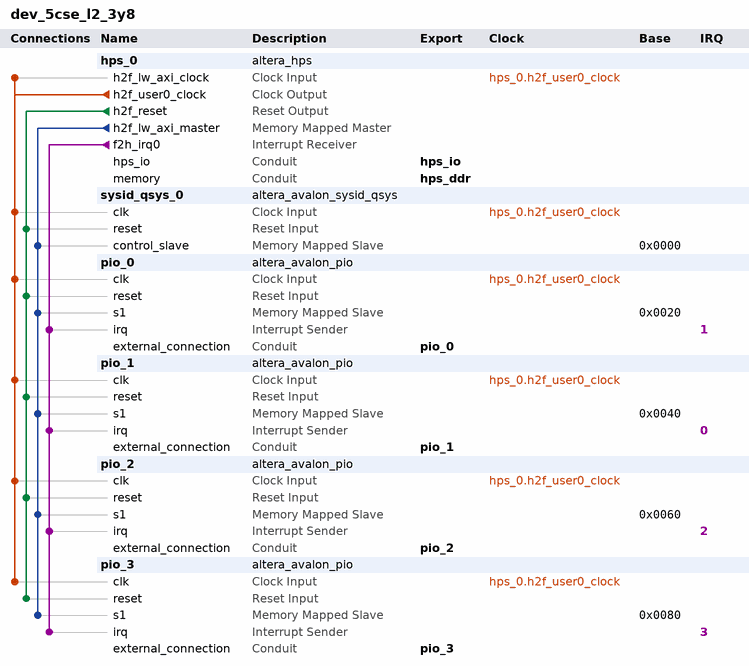
[diagram p0: system contents]
# Platform Designer (Qsys) system dev_5cse_l2_3y8, Cyclone V 5CSEBA2U23C8S
# Parameters at their usual value, and those the tool derives, are not listed.
package require -exact qsys 20.1
create_system dev_5cse_l2_3y8
set_project_property DEVICE_FAMILY {Cyclone V}
set_project_property DEVICE 5CSEBA2U23C8S

add_instance hps_0 altera_hps 20.1
set_instance_parameter_value hps_0 CAN0_Mode CAN
set_instance_parameter_value hps_0 CAN0_PinMuxing {HPS I/O Set 0}
set_instance_parameter_value hps_0 CAN1_Mode CAN
set_instance_parameter_value hps_0 CAN1_PinMuxing {HPS I/O Set 1}
set_instance_parameter_value hps_0 EMAC1_Mode RGMII
set_instance_parameter_value hps_0 EMAC1_PinMuxing {HPS I/O Set 0}
set_instance_parameter_value hps_0 F2SCLK_COLDRST_Enable false
set_instance_parameter_value hps_0 F2SCLK_DBGRST_Enable false
set_instance_parameter_value hps_0 F2SCLK_WARMRST_Enable false
set_instance_parameter_value hps_0 F2SINTERRUPT_Enable true
set_instance_parameter_value hps_0 F2S_Width 0
set_instance_parameter_value hps_0 FPGA_PERIPHERAL_OUTPUT_CLOCK_FREQ_EMAC0_GTX_CLK 100
set_instance_parameter_value hps_0 FPGA_PERIPHERAL_OUTPUT_CLOCK_FREQ_EMAC0_MD_CLK 100.0
set_instance_parameter_value hps_0 FPGA_PERIPHERAL_OUTPUT_CLOCK_FREQ_EMAC1_GTX_CLK 100
set_instance_parameter_value hps_0 FPGA_PERIPHERAL_OUTPUT_CLOCK_FREQ_EMAC1_MD_CLK 100.0
set_instance_parameter_value hps_0 HPS_PROTOCOL DDR3
set_instance_parameter_value hps_0 I2C0_Mode I2C
set_instance_parameter_value hps_0 I2C0_PinMuxing {HPS I/O Set 1}
set_instance_parameter_value hps_0 I2C1_Mode I2C
set_instance_parameter_value hps_0 I2C1_PinMuxing {HPS I/O Set 0}
set_instance_parameter_value hps_0 LWH2F_Enable true
set_instance_parameter_value hps_0 MEM_ASR Automatic
set_instance_parameter_value hps_0 MEM_BANKADDR_WIDTH 3
set_instance_parameter_value hps_0 MEM_CLK_FREQ 400.0
set_instance_parameter_value hps_0 MEM_COL_ADDR_WIDTH 10
set_instance_parameter_value hps_0 MEM_DQ_WIDTH 16
set_instance_parameter_value hps_0 MEM_DRV_STR RZQ/7
set_instance_parameter_value hps_0 MEM_ROW_ADDR_WIDTH 15
set_instance_parameter_value hps_0 MEM_RTT_NOM RZQ/4
set_instance_parameter_value hps_0 MEM_RTT_WR {Dynamic ODT off}
set_instance_parameter_value hps_0 MEM_TCL 7
set_instance_parameter_value hps_0 MEM_TFAW_NS 30.0
set_instance_parameter_value hps_0 MEM_TRAS_NS 35.0
set_instance_parameter_value hps_0 MEM_TRCD_NS 13.75
set_instance_parameter_value hps_0 MEM_TRFC_NS 260.0
set_instance_parameter_value hps_0 MEM_TRP_NS 13.75
set_instance_parameter_value hps_0 MEM_TRRD_NS 10.0
set_instance_parameter_value hps_0 MEM_TRTP_NS 10.0
set_instance_parameter_value hps_0 MEM_VENDOR JEDEC
set_instance_parameter_value hps_0 MEM_VOLTAGE {1.35V DDR3L}
set_instance_parameter_value hps_0 MEM_WTCL 6
set_instance_parameter_value hps_0 QSPI_Mode {2 SS}
set_instance_parameter_value hps_0 QSPI_PinMuxing {HPS I/O Set 1}
set_instance_parameter_value hps_0 REF_CLK_FREQ 25.0
set_instance_parameter_value hps_0 S2FCLK_USER0CLK_Enable true
set_instance_parameter_value hps_0 S2FCLK_USER2CLK 5
set_instance_parameter_value hps_0 S2F_Width 0
set_instance_parameter_value hps_0 SDIO_Mode {4-bit Data}
set_instance_parameter_value hps_0 SDIO_PinMuxing {HPS I/O Set 0}
set_instance_parameter_value hps_0 SPIM1_Mode N/A
set_instance_parameter_value hps_0 SPIM1_PinMuxing Unused
set_instance_parameter_value hps_0 STM_Enable false
set_instance_parameter_value hps_0 TIMING_BOARD_AC_SKEW 0.0
set_instance_parameter_value hps_0 TIMING_BOARD_AC_TO_CK_SKEW 0.0
set_instance_parameter_value hps_0 TIMING_BOARD_DQ_TO_DQS_SKEW 0.0
set_instance_parameter_value hps_0 TIMING_BOARD_MAX_CK_DELAY 0.6
set_instance_parameter_value hps_0 TIMING_BOARD_MAX_DQS_DELAY 0.2
set_instance_parameter_value hps_0 TIMING_BOARD_SKEW_BETWEEN_DQS 0.01
set_instance_parameter_value hps_0 TIMING_BOARD_SKEW_CKDQS_DIMM_MAX 0.215
set_instance_parameter_value hps_0 TIMING_BOARD_SKEW_CKDQS_DIMM_MIN 0.092
set_instance_parameter_value hps_0 TIMING_BOARD_SKEW_WITHIN_DQS 0.0
set_instance_parameter_value hps_0 TIMING_TDH 45
set_instance_parameter_value hps_0 TIMING_TDQSCK 225
set_instance_parameter_value hps_0 TIMING_TDQSQ 100
set_instance_parameter_value hps_0 TIMING_TDQSS 0.27
set_instance_parameter_value hps_0 TIMING_TDS 10
set_instance_parameter_value hps_0 TIMING_TDSH 0.18
set_instance_parameter_value hps_0 TIMING_TDSS 0.18
set_instance_parameter_value hps_0 TIMING_TIH 120
set_instance_parameter_value hps_0 TIMING_TIS 170
set_instance_parameter_value hps_0 TIMING_TQSH 0.4
set_instance_parameter_value hps_0 UART0_Mode {No Flow Control}
set_instance_parameter_value hps_0 UART0_PinMuxing {HPS I/O Set 2}
set_instance_parameter_value hps_0 USB1_Mode SDR
set_instance_parameter_value hps_0 USB1_PinMuxing {HPS I/O Set 0}
set_instance_parameter_value hps_0 desired_cfg_clk_mhz 100.0
set_instance_parameter_value hps_0 desired_mpu_clk_mhz 600.0
set_instance_parameter_value hps_0 desired_qspi_clk_mhz 400.0
set_instance_parameter_value hps_0 use_default_mpu_clk false

add_instance sysid_qsys_0 altera_avalon_sysid_qsys 20.1
set_instance_parameter_value sysid_qsys_0 id 3

add_instance pio_0 altera_avalon_pio 20.1
set_instance_parameter_value pio_0 bitClearingEdgeCapReg true
set_instance_parameter_value pio_0 bitModifyingOutReg true
set_instance_parameter_value pio_0 captureEdge true
set_instance_parameter_value pio_0 direction Bidir
set_instance_parameter_value pio_0 generateIRQ true
set_instance_parameter_value pio_0 width 32

add_instance pio_1 altera_avalon_pio 20.1
set_instance_parameter_value pio_1 bitClearingEdgeCapReg true
set_instance_parameter_value pio_1 bitModifyingOutReg true
set_instance_parameter_value pio_1 captureEdge true
set_instance_parameter_value pio_1 direction Bidir
set_instance_parameter_value pio_1 generateIRQ true
set_instance_parameter_value pio_1 width 32

add_instance pio_2 altera_avalon_pio 20.1
set_instance_parameter_value pio_2 bitClearingEdgeCapReg true
set_instance_parameter_value pio_2 bitModifyingOutReg true
set_instance_parameter_value pio_2 captureEdge true
set_instance_parameter_value pio_2 direction Bidir
set_instance_parameter_value pio_2 generateIRQ true
set_instance_parameter_value pio_2 width 32

add_instance pio_3 altera_avalon_pio 20.1
set_instance_parameter_value pio_3 bitClearingEdgeCapReg true
set_instance_parameter_value pio_3 bitModifyingOutReg true
set_instance_parameter_value pio_3 captureEdge true
set_instance_parameter_value pio_3 direction Bidir
set_instance_parameter_value pio_3 generateIRQ true
set_instance_parameter_value pio_3 width 29

# connections
add_connection hps_0.h2f_user0_clock hps_0.h2f_lw_axi_clock clock
add_connection hps_0.h2f_user0_clock pio_0.clk clock
add_connection hps_0.h2f_user0_clock pio_1.clk clock
add_connection hps_0.h2f_user0_clock pio_2.clk clock
add_connection hps_0.h2f_user0_clock pio_3.clk clock
add_connection hps_0.h2f_user0_clock sysid_qsys_0.clk clock
add_connection hps_0.h2f_reset pio_0.reset reset
add_connection hps_0.h2f_reset pio_1.reset reset
add_connection hps_0.h2f_reset pio_2.reset reset
add_connection hps_0.h2f_reset pio_3.reset reset
add_connection hps_0.h2f_reset sysid_qsys_0.reset reset
add_connection hps_0.h2f_lw_axi_master pio_0.s1 avalon
set_connection_parameter_value hps_0.h2f_lw_axi_master/pio_0.s1 baseAddress 0x0020
add_connection hps_0.h2f_lw_axi_master pio_1.s1 avalon
set_connection_parameter_value hps_0.h2f_lw_axi_master/pio_1.s1 baseAddress 0x0040
add_connection hps_0.h2f_lw_axi_master pio_2.s1 avalon
set_connection_parameter_value hps_0.h2f_lw_axi_master/pio_2.s1 baseAddress 0x0060
add_connection hps_0.h2f_lw_axi_master pio_3.s1 avalon
set_connection_parameter_value hps_0.h2f_lw_axi_master/pio_3.s1 baseAddress 0x0080
add_connection hps_0.h2f_lw_axi_master sysid_qsys_0.control_slave avalon
set_connection_parameter_value hps_0.h2f_lw_axi_master/sysid_qsys_0.control_slave baseAddress 0x0000
add_connection hps_0.f2h_irq0 pio_0.irq interrupt
set_connection_parameter_value hps_0.f2h_irq0/pio_0.irq irqNumber 1
add_connection hps_0.f2h_irq0 pio_1.irq interrupt
set_connection_parameter_value hps_0.f2h_irq0/pio_1.irq irqNumber 0
add_connection hps_0.f2h_irq0 pio_2.irq interrupt
set_connection_parameter_value hps_0.f2h_irq0/pio_2.irq irqNumber 2
add_connection hps_0.f2h_irq0 pio_3.irq interrupt
set_connection_parameter_value hps_0.f2h_irq0/pio_3.irq irqNumber 3

# exported interfaces
add_interface hps_ddr conduit end
set_interface_property hps_ddr EXPORT_OF hps_0.memory
add_interface hps_io conduit end
set_interface_property hps_io EXPORT_OF hps_0.hps_io
add_interface pio_0 conduit end
set_interface_property pio_0 EXPORT_OF pio_0.external_connection
add_interface pio_1 conduit end
set_interface_property pio_1 EXPORT_OF pio_1.external_connection
add_interface pio_2 conduit end
set_interface_property pio_2 EXPORT_OF pio_2.external_connection
add_interface pio_3 conduit end
set_interface_property pio_3 EXPORT_OF pio_3.external_connection

set_interconnect_requirement {$system} qsys_mm.clockCrossingAdapter HANDSHAKE
set_interconnect_requirement {$system} qsys_mm.maxAdditionalLatency 4

save_system dev_5cse_l2_3y8.qsys
